# Altium project TP3_Microcontrolador.PrjPcb (part 2 of 2)

## Sheet uC_Essentials.SchDoc
size A4; SheetNumber: 5; SheetTotal: 13
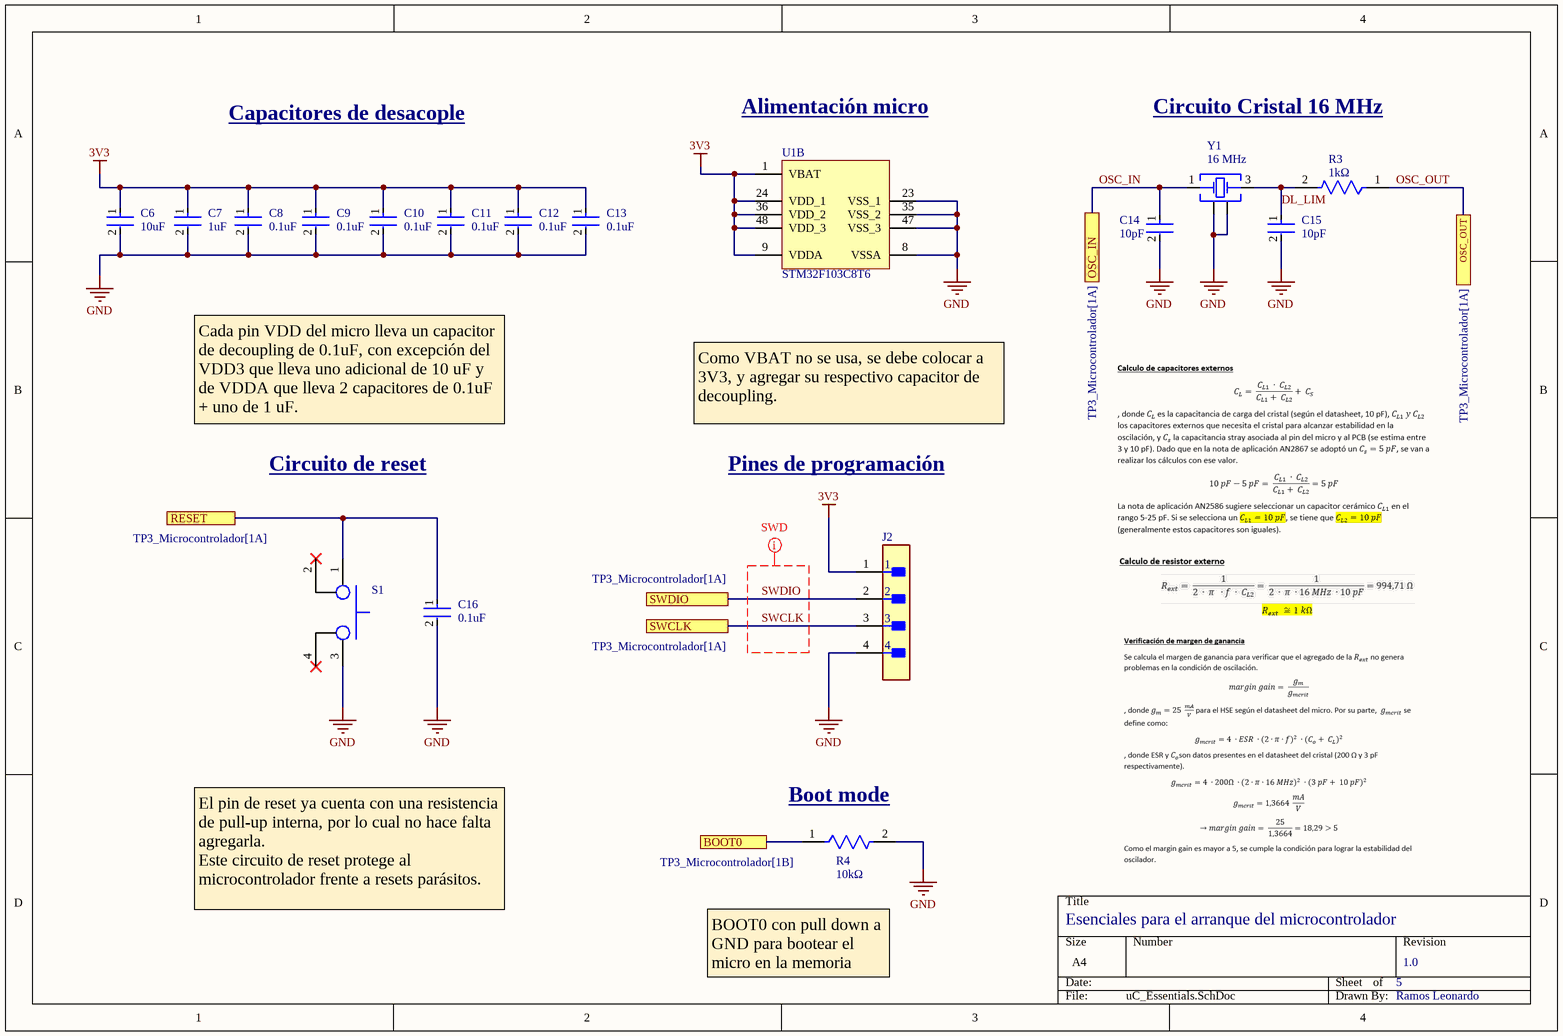
[diagram p11: uC_Essentials.SchDoc]

### Parts
C6  value 10uF  [FP-CC0805-0_85-MFG]  (hidden comment: CC0805KRX7R8BB104)
C7  value 1uF  [FP-CC0805-0_85-MFG]  (hidden comment: CC0805KRX7R8BB104)
C8  value 0.1uF  [FP-CC0805-0_85-MFG]  (hidden comment: CC0805KRX7R8BB104)
C9  value 0.1uF  [FP-CC0805-0_85-MFG]  (hidden comment: CC0805KRX7R8BB104)
C10  value 0.1uF  [FP-CC0805-0_85-MFG]  (hidden comment: CC0805KRX7R8BB104)
C11  value 0.1uF  [FP-CC0805-0_85-MFG]  (hidden comment: CC0805KRX7R8BB104)
C12  value 0.1uF  [FP-CC0805-0_85-MFG]  (hidden comment: CC0805KRX7R8BB104)
C13  value 0.1uF  [FP-CC0805-0_85-MFG]  (hidden comment: CC0805KRX7R8BB104)
C14  value 10pF  [FP-CC0805-0_85-MFG]  (hidden comment: CC0805KRX7R8BB104)
C15  value 10pF  [FP-CC0805-0_85-MFG]  (hidden comment: CC0805KRX7R8BB104)
C16  value 0.1uF  [FP-CC0805-0_85-MFG]  (hidden comment: CC0805KRX7R8BB104)
J2  HTSW-104-07-G-S  [FP-HTSW-104-07-G-S-MFG]  (value not drawn)
R3  Resistance: 1kΩ  [FP-CRCW0805-e3-IPC_B]  (hidden comment: CRCW08054K70JNEA)
R4  Resistance: 10kΩ  [FP-CRCW0805-e3-IPC_B]  (hidden comment: CRCW08054K70JNEA)
S1  Tactile push button  [FP-B3W-1000-MFG]  (value not drawn)
U1  STM32F103C8T6  [STM-LQFP48_L]  (part B of 2)
Y1  16 MHz  [WE-XTAL_IQXC-42]

### Ports
BOOT0 (see TP3_Microcontrolador[1B]), OSC_IN (see TP3_Microcontrolador[1A]), OSC_OUT (see TP3_Microcontrolador[1A]), RESET (see TP3_Microcontrolador[1A]), SWCLK (see TP3_Microcontrolador[1A]), SWDIO (see TP3_Microcontrolador[1A])

### Nets
3V3: C6.1 C7.1 C8.1 C9.1 C10.1 C11.1 C12.1 C13.1 J2.1 U1.1(VBAT) U1.9(VDDA) U1.24(VDD_1) U1.36(VDD_2) U1.48(VDD_3)
GND: C6.2 C7.2 C8.2 C9.2 C10.2 C11.2 C12.2 C13.2 C14.2 C15.2 C16.2 J2.4 R4.2 S1.3 U1.8(VSSA) U1.23(VSS_1) U1.35(VSS_2) U1.47(VSS_3) Y1.2(GND) Y1.4(GND)
DL_LIM: C15.1 R3.2 Y1.3(Crystal)
MCU_BOOT0: R4.1 ; port BOOT0
MCU_RESET: C16.1 S1.1 ; port RESET
OSC_IN: C14.1 Y1.1(Crystal) ; port OSC_IN  [project net MCU_OSC_IN]
OSC_OUT: R3.1 ; port OSC_OUT  [project net MCU_OSC_OUT]
SWCLK: J2.3 ; port SWCLK
SWDIO: J2.2 ; port SWDIO

Not connected (* = marked no-connect by the designer): S1 2* 4*

### Layout directives
net class SWD: SWCLK, SWDIO

### Notes on the sheet
- Alimentación micro
- Circuito Cristal 16 MHz
- Capacitores de desacople
- Cada pin VDD del micro lleva un capacitor de decoupling de 0.1uF, con excepción del VDD3 que lleva uno adicional de 10 uF y de VDDA que lleva 2 capacitores de 0.1uF + uno de 1 uF.
- Como VBAT no se usa, se debe colocar a 3V3, y agregar su respectivo capacitor de decoupling.
- Circuito de reset
- Pines de programación
- (near R4) Boot mode
- El pin de reset ya cuenta con una resistencia de pull-up interna, por lo cual no hace falta agregarla.
  Este circuito de reset protege al microcontrolador frente a resets parásitos.
- Esenciales para el arranque del microcontrolador
- BOOT0 con pull down a GND para bootear el micro en la memoria flash principal.
- 5
- 1.0
- Ramos Leonardo

### Library data of the parts
C6 = CMP-1036-04410-2: CAP CER 4.7UF 25V X7R 0805; Manufacturer: Yageo; Tolerance: 0.1; Material: Ceramic; ComponentLink2URL: http://www.yageo.com/documents/recent/UPY-GPHC_Y5V_6.3V-to-50V_8.pdf; Category: Cap; Mouser Description: Multilayer Ceramic Capacitors MLCC - SMD/SMT 100nF 25V X7R 10%; Manufacturer Part Number: CC0805KRX7R8BB104; Device Class L1: Passive Components; Footprint Url: http://www.yageo.com/exep/pages/download/literatures/UPY-C_GEN_24.pdf; Height: 0.95mm; Digikey Description: CAP CER 0.1UF 25V X7R 0805; Lead Free: Yes; Temperature Range High: +85°C; Temperature: -30°C to +85°C; Ipc Land Pattern Name: CAPC200125X85; Capacitance: 10uF; Automotive: No; Octopart: https://octopart.com/cc0805krx7r8bb104-yageo-39467766; Device Class L2: Capacitors; Temperature Characteristic: X7R; Voltage Rating: 25 V; ComponentLink2Description: Datasheet; Temperature Range Low: -30°C; Device Class L3: Ceramic Capacitors; RoHS: TRUE; Package: CC0805-0.85
C7 = CMP-1036-04410-2: CAP CER 1UF 25V X7R 0805; Manufacturer: Yageo; Tolerance: 0.1; Material: Ceramic; ComponentLink2URL: http://www.yageo.com/documents/recent/UPY-GPHC_Y5V_6.3V-to-50V_8.pdf; Category: Cap; Mouser Description: Multilayer Ceramic Capacitors MLCC - SMD/SMT 100nF 25V X7R 10%; Manufacturer Part Number: CC0805KRX7R8BB104; Device Class L1: Passive Components; Footprint Url: http://www.yageo.com/exep/pages/download/literatures/UPY-C_GEN_24.pdf; Height: 0.95mm; Digikey Description: CAP CER 0.1UF 25V X7R 0805; Lead Free: Yes; Temperature Range High: +85°C; Temperature: -30°C to +85°C; Ipc Land Pattern Name: CAPC200125X85; Capacitance: 1uF; Automotive: No; Octopart: https://octopart.com/cc0805krx7r8bb104-yageo-39467766; Device Class L2: Capacitors; Temperature Characteristic: X7R; Voltage Rating: 25 V; ComponentLink2Description: Datasheet; Temperature Range Low: -30°C; Device Class L3: Ceramic Capacitors; RoHS: TRUE; Package: CC0805-0.85
C8-C13 C16 = CMP-1036-04410-2: CAP CER 0.1UF 25V X7R 0805; Manufacturer: Yageo; Tolerance: 0.1; Material: Ceramic; Capacitance: 100 nF; ComponentLink2URL: http://www.yageo.com/documents/recent/UPY-GPHC_Y5V_6.3V-to-50V_8.pdf; Category: Cap; Mouser Description: Multilayer Ceramic Capacitors MLCC - SMD/SMT 100nF 25V X7R 10%; Manufacturer Part Number: CC0805KRX7R8BB104; Device Class L1: Passive Components; Footprint Url: http://www.yageo.com/exep/pages/download/literatures/UPY-C_GEN_24.pdf; Height: 0.95mm; Digikey Description: CAP CER 0.1UF 25V X7R 0805; Lead Free: Yes; Temperature Range High: +85°C; Temperature: -30°C to +85°C; Ipc Land Pattern Name: CAPC200125X85; Automotive: No; Octopart: https://octopart.com/cc0805krx7r8bb104-yageo-39467766; Device Class L2: Capacitors; Temperature Characteristic: X7R; Voltage Rating: 25 V; ComponentLink2Description: Datasheet; Temperature Range Low: -30°C; Device Class L3: Ceramic Capacitors; RoHS: TRUE; Package: CC0805-0.85
C14 C15 = CMP-1036-04410-2: CAP CER 10pF 25V X7R 0805; Manufacturer: Yageo; Tolerance: 0.1; Material: Ceramic; ComponentLink2URL: http://www.yageo.com/documents/recent/UPY-GPHC_Y5V_6.3V-to-50V_8.pdf; Category: Cap; Mouser Description: Multilayer Ceramic Capacitors MLCC - SMD/SMT 100nF 25V X7R 10%; Manufacturer Part Number: CC0805KRX7R8BB104; Device Class L1: Passive Components; Footprint Url: http://www.yageo.com/exep/pages/download/literatures/UPY-C_GEN_24.pdf; Height: 0.95mm; Digikey Description: CAP CER 0.1UF 25V X7R 0805; Lead Free: Yes; Temperature Range High: +85°C; Temperature: -30°C to +85°C; Ipc Land Pattern Name: CAPC200125X85; Capacitance: 10pF; Automotive: No; Octopart: https://octopart.com/cc0805krx7r8bb104-yageo-39467766; Device Class L2: Capacitors; Temperature Characteristic: X7R; Voltage Rating: 25 V; ComponentLink2Description: Datasheet; Temperature Range Low: -30°C; Device Class L3: Ceramic Capacitors; RoHS: TRUE; Package: CC0805-0.85
J2 = CMP-02766-001776-1: CONN HEADER VERT 4POS 2.54MM; Gender: Male; Number of Contacts: 4; Packaging: Bulk; RoHS Compliant: Yes; Number of Rows: 1; Mount: Through Hole; Contact Material: Bronze; Series: HTSW; Radiation Hardening: No; Pitch: 2.54mm; Reach SVHC Compliant: Yes; Contact Plating: Gold; Termination: Through Hole
R3 = CMP-2001-03967-2: RES Thick Film, 1kΩ, 5%, 0.125W, 200ppm/°C, 0805; Power Rating: 125mW; Voltage Rating: 150V; Radiation Hardening: No; Case Code (Imperial): 0805; Military Standard: Not; Contact Plating: Tin; Weight: 0.000194oz; Mount: Surface Mount; Termination: SMD/SMT; Packaging: Tape and Reel; Min Operating Temperature: -55°C; Width: 1.25mm; Tolerance: 5%; Height: 0.45mm; Depth: 1.25mm; Length: 2mm; Temperature Coefficient: 200ppm/°C; Case Code (Metric): 2012; Package Quantity: 5000; Max Operating Temperature: 155°C; Case/Package: 0805; Composition: Thick Film
R4 = CMP-2001-03967-2: RES Thick Film, 5%, 0.125W, 200ppm/°C, 0805; Power Rating: 125mW; Voltage Rating: 150V; Radiation Hardening: No; Case Code (Imperial): 0805; Military Standard: Not; Contact Plating: Tin; Weight: 0.000194oz; Mount: Surface Mount; Termination: SMD/SMT; Packaging: Tape and Reel; Min Operating Temperature: -55°C; Width: 1.25mm; Tolerance: 5%; Height: 0.45mm; Depth: 1.25mm; Length: 2mm; Temperature Coefficient: 200ppm/°C; Case Code (Metric): 2012; Package Quantity: 5000; Max Operating Temperature: 155°C; Case/Package: 0805; Composition: Thick Film
U1 = CMP-0237-00215-3: ARM Cortex-M3 32-bit MCU, 64 KB Flash, 20 KB Internal RAM, 37 I/Os, 48-pin LQFP, -40 to 85 degC, Tray; Supply Voltage(Vcc) min (V): 2; Internal RAM Size (kB): 20; FLASH Size (Prog) (kB): 64; A/D Converter: 2x12-bit (10 Channel); I/Os (High Current): 37; Operating Frequency(F) (Processor speed) (MHz): 72; Core: ARM Cortex-M3; ComponentLink3Description: Package Specification; Mounting Technology: Surface Mount; PartNumber: STM32F103C8T6; PackageReference: LQFP48; Packing: Tray; ComponentLink3URL: http://www.st.com/st-web-ui/static/active/en/resource/technical/document/datasheet/DM00058181.pdf; DatasheetVersion: Rev. 16; ComponentLink1URL: http://www.st.com/web/en/home.html; PackageVersion: Rev. 6, 06/2013; ComponentLink2URL: http://www.st.com/st-web-ui/static/active/en/resource/technical/document/datasheet/CD00161566.pdf; ComponentLink1Description: Manufacturer URL; ComponentLink2Description: Datasheet; PackageDescription: 48-Pin Low Profile Quad Flat Package, 7 x 7 mm Body, 0.5 mm Pitch
Y1 = CMP-03913-116855783-1: 830108288709 WE-XTAL Quartz Crystal; Frequency: 16MHz; Width: 1.6mm; Length: 2mm; Max Operating Temperature: 105°C; NexarPartId: 116855783; Min Operating Temperature: -40°C; Height: 500µm

## Sheet USB_Interface.SchDoc
size A4; SheetNumber: 13; SheetTotal: 13
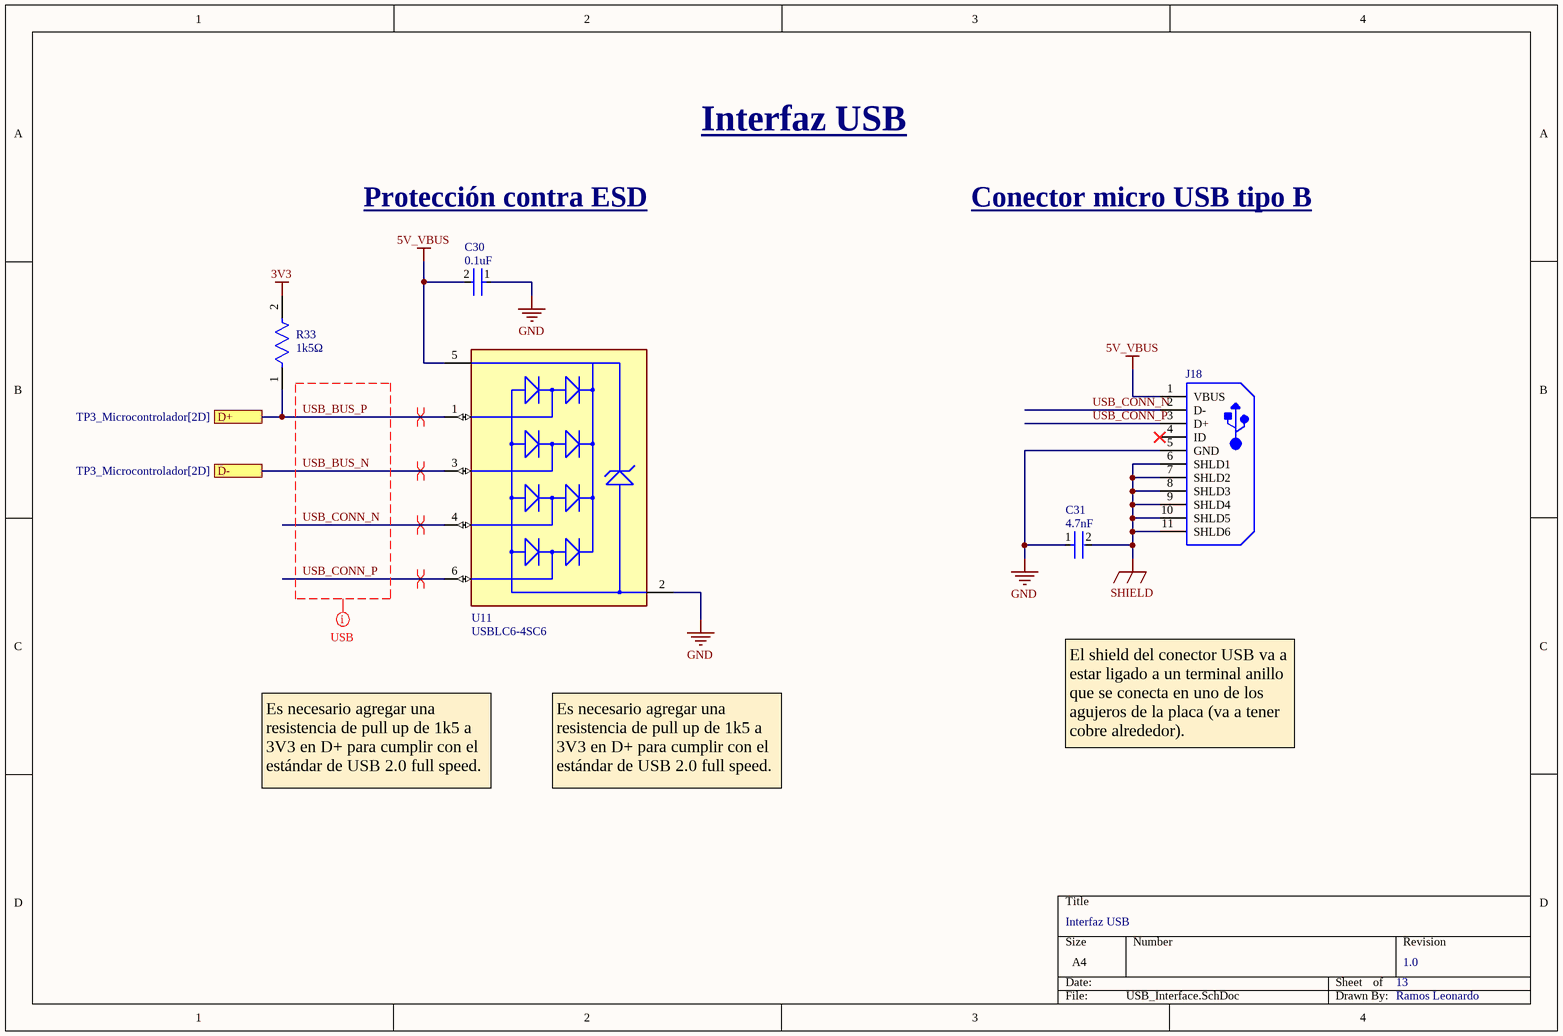
[diagram p12: USB_Interface.SchDoc]

### Parts
C30  value 0.1uF  [FP-CC0805-0_85-MFG]  (hidden comment: CC0805KRX7R8BB104)
C31  Capacitance: 4.7nF  [FP-GRM21B-0_1-IPC_B]  (hidden comment: GRM21B7U1A104JA01L)
J18  105017-0001  [USB-MICRO-B_V]  (value not drawn)
R33  Resistance: 1k5Ω  [FP-CRCW0805-e3-IPC_B]  (hidden comment: CRCW08054K70JNEA)
U11  USBLC6-4SC6  [FP-SOT23-6L-MFG]

### Ports
D+ (see TP3_Microcontrolador[2D]), D- (see TP3_Microcontrolador[2D])

### Nets
3V3: R33.2
5V_VBUS: C30.2 J18.1(VBUS) U11.5(VBUS)
GND: C30.1 C31.1 J18.5(GND) U11.2(GND)
SHIELD: C31.2 J18.6(SHLD1) J18.7(SHLD2) J18.8(SHLD3) J18.9(SHLD4) J18.10(SHLD5) J18.11(SHLD6)
USB_BUS_N: U11.3(I/O2) ; port D-
USB_BUS_P: R33.1 U11.1(I/O1) ; port D+
USB_CONN_N: J18.2(D-) U11.4(I/O3)
USB_CONN_P: J18.3(D+) U11.6(I/O4)

Not connected (* = marked no-connect by the designer): J18 4(ID)*

### Layout directives
differential pair: USB_BUS_N, USB_BUS_P, USB_CONN_N, USB_CONN_P
net class USB: USB_BUS_N, USB_BUS_P, USB_CONN_N, USB_CONN_P

### Notes on the sheet
- Interfaz USB
- Protección contra ESD
- Conector micro USB tipo B
- Es necesario agregar una resistencia de pull up de 1k5 a 3V3 en D+ para cumplir con el estándar de USB 2.0 full speed.
- El shield del conector USB va a estar ligado a un terminal anillo que se conecta en uno de los agujeros de la placa (va a tener cobre alrededor).
- 13
- 1.0
- Ramos Leonardo

### Library data of the parts
C30 = CMP-1036-04410-2: as C8 on sheet uC_Essentials; ComponentLink2URL: http://www.yageo.com/documents/recent/UPY-GPHC_Y5V_6.3V-to-50V_8.pdf; Category: Cap; Mouser Description: Multilayer Ceramic Capacitors MLCC - SMD/SMT 100nF 25V X7R 10%; Manufacturer Part Number: CC0805KRX7R8BB104; Device Class L1: Passive Components; Footprint Url: http://www.yageo.com/exep/pages/download/literatures/UPY-C_GEN_24.pdf; Height: 0.95mm; Digikey Description: CAP CER 0.1UF 25V X7R 0805; Lead Free: Yes; Temperature Range High: +85°C; Temperature: -30°C to +85°C; Ipc Land Pattern Name: CAPC200125X85; Automotive: No; Octopart: https://octopart.com/cc0805krx7r8bb104-yageo-39467766; Device Class L2: Capacitors; Temperature Characteristic: X7R; Voltage Rating: 25 V; ComponentLink2Description: Datasheet; Temperature Range Low: -30°C; Device Class L3: Ceramic Capacitors; RoHS: TRUE; Package: CC0805-0.85
C31 = CMP-06035-037063-1: Chip Multilayer Ceramic Capacitors for General Purpose, 0805, 4.7nF, U2J, -750ppm/°C, 5%, 10V; Depth: 1.25mm; Voltage Rating (DC): 10V; Voltage Rating: 10V; Length: 2mm; Max Operating Temperature: 125°C; Thickness: 0.053inch; Dielectric: U2J; Termination: SMD/SMT; Package Quantity: 3000; Packaging: Tape and Reel; Case Code (Metric): 2012; Tolerance: 5%; Case Code (Imperial): 0805; Case/Package: 0805; Mount: Surface Mount; Width: 0.049inch; Height: 1.25mm; Radiation Hardening: No; Min Operating Temperature: -55°C
J18 = CMP-2000-05827-1: Micro-USB B Receptacle, Right Angle, Bottom Mount, Surface Mount, with Solder Tabs, -30 to 85 degC, 5-Pin USB, RoHS, Tape and Reel; Manufacturer: Molex; Featured Product: Micro-USBConnectorsUSBConnectors; Other Names: WM1399DKR; Package Version: Rev. F, 12/2012; Number of Contacts: 5; Connector Type: USB-microB; Catalog Drawings: 1050170001; 3D Model: 105017-0001.stp; Mating Products: WM17145-ND-CABLEMICROUSBBTOSTDA1.0MWM17147-ND-CABLEMICROUSBBTOSTDA2.0MWM17146-ND-CABLEMICROUSBBTOSTDA1.5M; PCN Assembly/Origin: ResinSupplier21/Oct/2015; Voltage - Max: 30V; Online Catalog: Molex-MicroUSB; Manufacturer URL: http://www.molex.com/; Package Description: 5-Leads USB, Micro B, Body 7.5 x 5 mm, Pitch 0.65 mm; Datasheet URL: http://www.molex.com/elqNow/elqRedir.htm?ref=http://www.molex.com/webdocs/datasheets/pdf/en-us/1050170001_IO_CONNECTORS.pdf; Ingress Protection: -; Datasheet Version: 03/2016; Mounting Type: BoardCutout,SurfaceMount,RightAngle; Circuits: 5; Standard Package: 1; Package Reference: MICRO-B; Package URL: http://www.molex.com/pdm_docs/sd/1050170001_sd.pdf; Category: Connectors,Interconnects; Series: -; RoHS Information: 1050170001CertofCompliance; Features: Shielded,SolderRetention; Family: USB,DVI,HDMIConnectors; Specifications: -; Gender: Receptacle; Packaging: Digi-Reel®; Mounting Technology: SurfaceMount
R33 = CMP-2001-03967-2: as R4 on sheet uC_Essentials; Radiation Hardening: No; Case Code (Imperial): 0805; Military Standard: Not; Contact Plating: Tin; Weight: 0.000194oz; Mount: Surface Mount; Termination: SMD/SMT; Packaging: Tape and Reel; Min Operating Temperature: -55°C; Width: 1.25mm; Tolerance: 5%; Height: 0.45mm; Depth: 1.25mm; Length: 2mm; Temperature Coefficient: 200ppm/°C; Case Code (Metric): 2012; Package Quantity: 5000; Max Operating Temperature: 155°C; Case/Package: 0805; Composition: Thick Film
U11 = CMP-2000-07370-2: TVS DIODE 5.25V 17V SOT23-6; Manufacturer: STMicroelectronics; Peak Pulse Power: 130W; Breakdown Voltage: 6V; Value: 3pF; Direction: Unidirectional; Interface: USB,Ethernet,Other; Number Of Channels: 4; Standoff Height: 0mm; Max Junction Temp: +125°C; Digikey Description: TVS DIODE 5.25V 17V SOT23-6; Automotive: No; Package: SOT23-6L; Mouser Description: USBLC6 Series 4 Line 6 V Uni / Bi-Directional ESD Protection - SOT-23-6; Octopart: https://octopart.com/usblc6-4sc6-stmicroelectronics-347147; RoHS: TRUE; ComponentLink2URL: https://upverter.com/datasheet/23dc4ffb028d868909e80577610284b194f13213.pdf; ComponentLink2Description: Datasheet; Device Class L1: Circuit Protection; Lead Free: Yes; Temperature Range High: +125°C; Device Class L2: ESD and Circuit Protection ICs; Device Class L3: unset; Capacitance: 3pF; Height: 1.45mm; Temperature Range Low: -40°C; Manufacturer Part Number: USBLC6-4SC6; Temperature: -40°C to +125°C; Category: Diode; Clamping Voltage: 17V

## Nets that join several sheets
3V3: LDO_regulator (C5.1 U3.4), Analog_Inputs_10V (C17.1 U4.4), Analog_Inputs_12V (C18.1 U5.14), Digital_Inputs_24V (R17.2 R19.2 R21.2), Serial_Communication (C22.1 C23.1 U9.16), I2C_Modules (5 pins), uC_Essentials (14 pins), USB_Interface (R33.2)
5V: Buck_Converter (C2.1 C3.1 L1.2 R1.2), LDO_regulator (C4.1 U3.3)
GND: Buck_Converter (9 pins), LDO_regulator (C4.2 C5.2 U3.1), Analog_Inputs_10V (9 pins), Analog_Inputs_12V (11 pins), Digital_Inputs_24V (6 pins), Relay_Control_Outputs (7 pins), Serial_Communication (5 pins), Debug_Leds (R29.1 R30.1), I2C_Modules (6 pins), uC_Essentials (20 pins), USB_Interface (C30.1 C31.1 J18.5 U11.2)
COND_ADC: TP3_Microcontrolador (U1.12), Analog_Inputs_10V (U4.6 U4.7)
DEBUG_LED_1: TP3_Microcontrolador (U1.18), Debug_Leds (D8.1)
DEBUG_LED_2: TP3_Microcontrolador (U1.19), Debug_Leds (D9.1)
I2C_SCL: TP3_Microcontrolador (U1.21), I2C_Modules (J17.2 R32.1 U10.6)
I2C_SDA: TP3_Microcontrolador (U1.22), I2C_Modules (J17.3 R31.1 U10.5)
MCU_BOOT0: TP3_Microcontrolador (U1.44), uC_Essentials (R4.1)
MCU_OSC_IN: TP3_Microcontrolador (U1.5), uC_Essentials (C14.1 Y1.1)
MCU_OSC_OUT: TP3_Microcontrolador (U1.6), uC_Essentials (R3.1)
MCU_RESET: TP3_Microcontrolador (U1.7), uC_Essentials (C16.1 S1.1)
PH_ADC: TP3_Microcontrolador (U1.11), Analog_Inputs_10V (U4.1 U4.2)
PUMP_STATE_1: TP3_Microcontrolador (U1.25), Digital_Inputs_24V (C19.1 R17.1 U6.4)
PUMP_STATE_2: TP3_Microcontrolador (U1.26), Digital_Inputs_24V (C20.1 R19.1 U7.4)
PUMP_STATE_3: TP3_Microcontrolador (U1.27), Digital_Inputs_24V (C21.1 R21.1 U8.4)
SWCLK: TP3_Microcontrolador (U1.37), uC_Essentials (J2.3)
SWDIO: TP3_Microcontrolador (U1.34), uC_Essentials (J2.2)
TANK_STATE_1: TP3_Microcontrolador (U1.14), Analog_Inputs_12V (U5.2)
TANK_STATE_2: TP3_Microcontrolador (U1.15), Analog_Inputs_12V (U5.4)
TANK_STATE_3: TP3_Microcontrolador (U1.16), Analog_Inputs_12V (U5.6)
TDS_ADC: TP3_Microcontrolador (U1.13), Analog_Inputs_10V (U4.8 U4.9)
TR_OUT_1: TP3_Microcontrolador (U1.39), Relay_Control_Outputs (R23.2 R25.1)
TR_OUT_2: TP3_Microcontrolador (U1.40), Relay_Control_Outputs (R24.2 R26.1)
TR_OUT_3: TP3_Microcontrolador (U1.41), Relay_Control_Outputs (R27.2 R28.1)
UART_RX: TP3_Microcontrolador (U1.43), Serial_Communication (U9.12)
UART_TX: TP3_Microcontrolador (U1.42), Serial_Communication (U9.11)
USB_BUS_N: TP3_Microcontrolador (U1.32), USB_Interface (U11.3)
USB_BUS_P: TP3_Microcontrolador (U1.33), USB_Interface (R33.1 U11.1)